# Altium schematic sheet MCU.SchDoc
size 381 x 241 mm; SheetNumber: 1; SheetTotal: 3
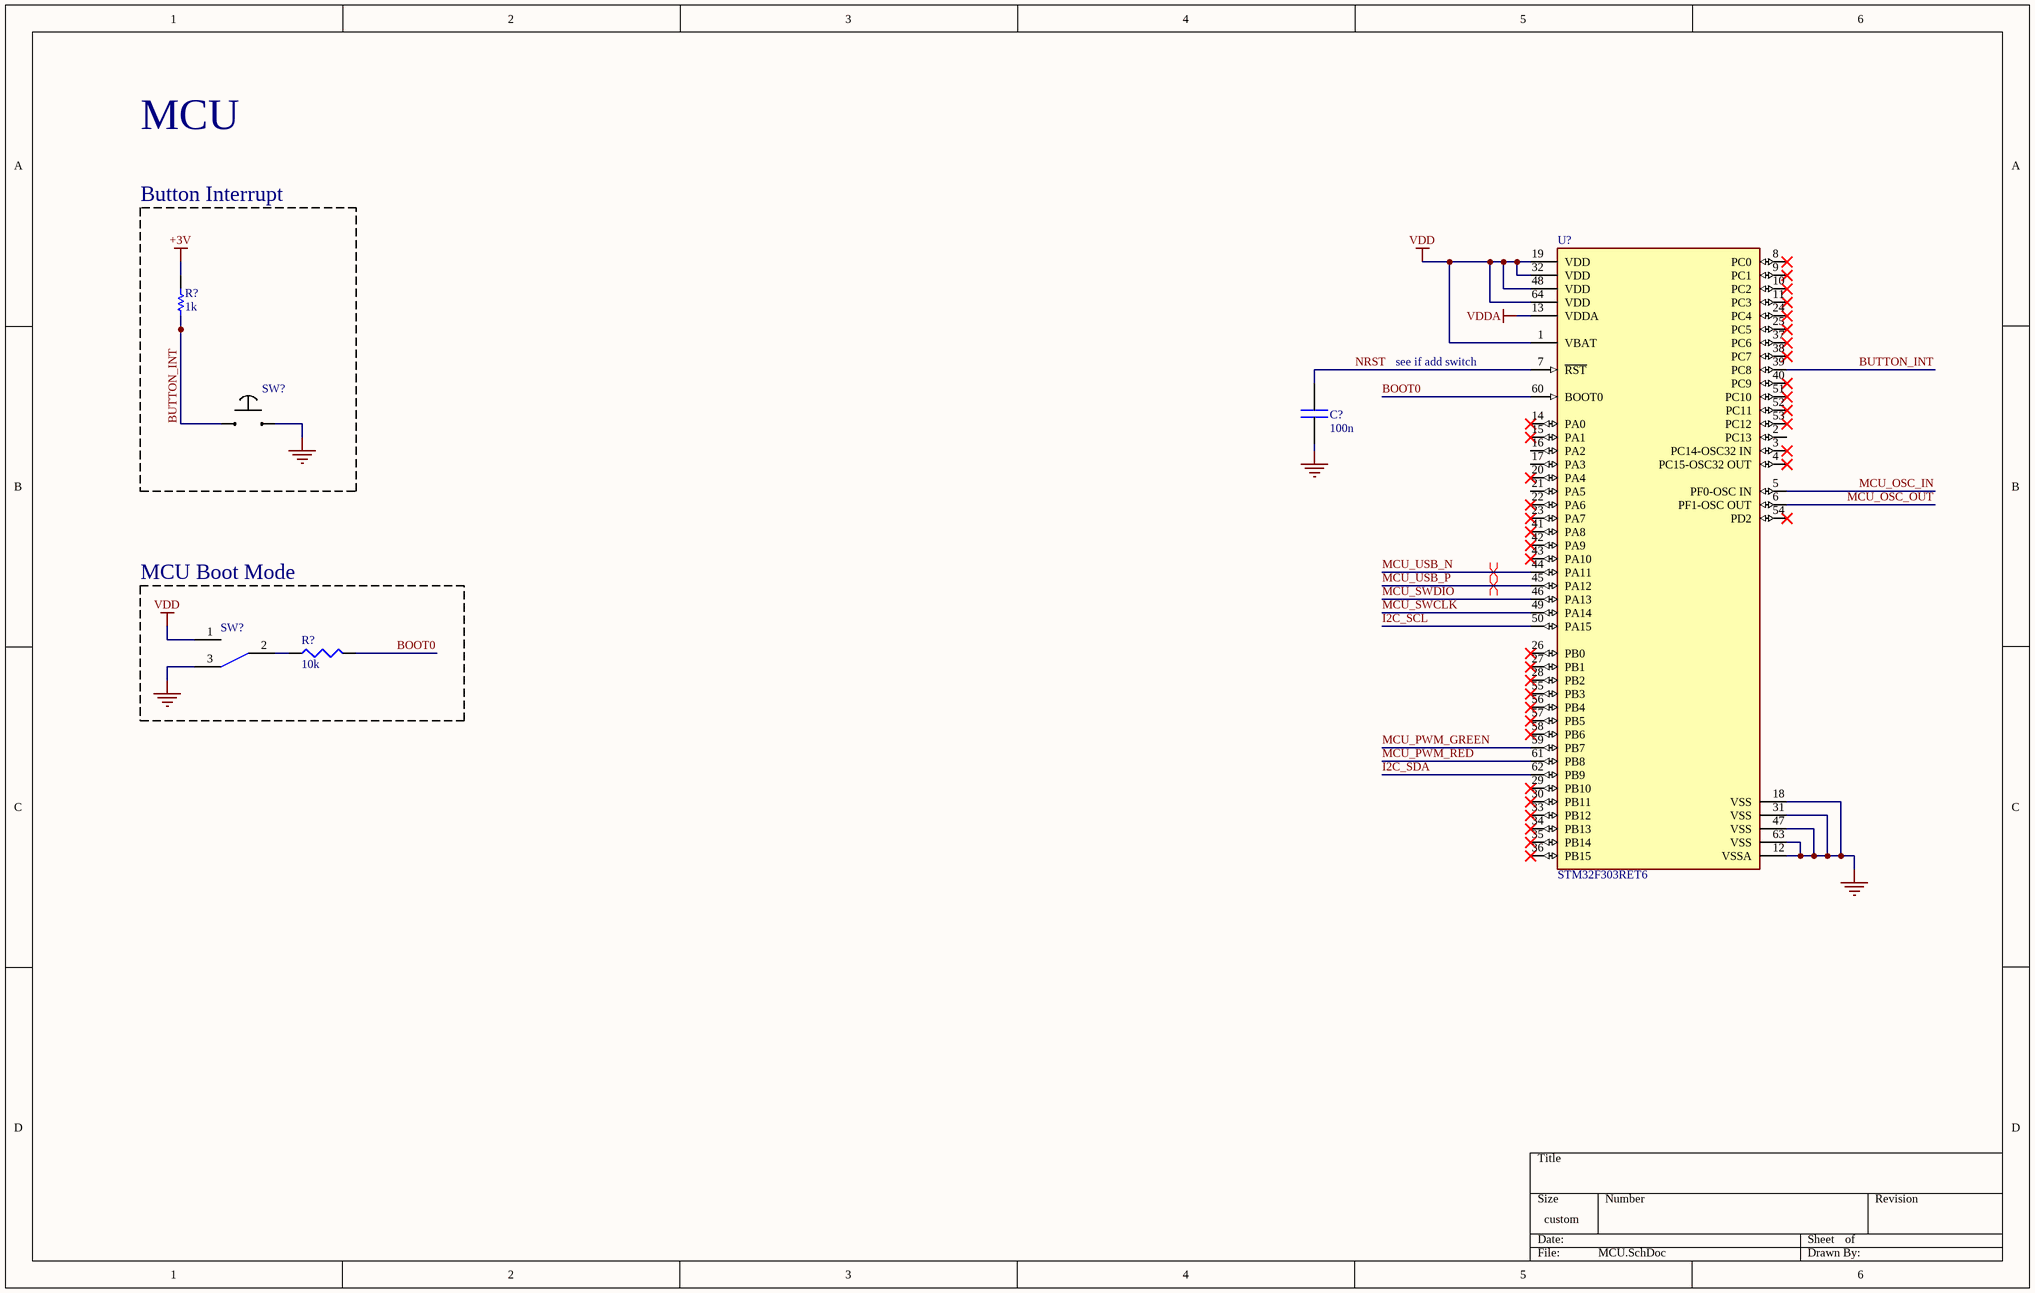
[diagram p0: MCU.SchDoc]

## Parts
(Parts that share a designator on the sheet are numbered #1, #2 ... from top to bottom, then left to right.)
C?  100n
R?#1  1k  [RESC1608X55X25LL10T15]
R?#2  10k
SW?#1  Momentary Button  (value not drawn)
SW?#2  CJS-1200TB1  (value not drawn)
U?  STM32F303RET6  [FP-LQFP64-5W-MFG]

## Blocks framed on the sheet
Button Interrupt: R?#1 SW?#1
MCU Boot Mode: R?#2 SW?#2

## Nets
+3V: R?#1.2
GND: C?.2 SW?#1.1 U?.12(VSSA) U?.18(VSS) U?.31(VSS) U?.47(VSS) U?.63(VSS)
VDD: U?.1(VBAT) U?.19(VDD) U?.32(VDD) U?.48(VDD) U?.64(VDD)
VDDA: U?.13(VDDA)
BOOT0: R?#2.2 U?.60(BOOT0)
BUTTON_INT: R?#1.1 SW?#1.0 U?.39(PC8)
I2C_SCL: U?.50(PA15)
I2C_SDA: U?.62(PB9)
MCU_OSC_IN: U?.5(PF0-OSC_IN)
MCU_OSC_OUT: U?.6(PF1-OSC_OUT)
MCU_PWM_GREEN: U?.59(PB7)
MCU_PWM_RED: U?.61(PB8)
MCU_SWCLK: U?.49(PA14)
MCU_SWDIO: U?.46(PA13)
MCU_USB_N: U?.44(PA11)
MCU_USB_P: U?.45(PA12)
NRST: C?.1 U?.7(~{RST})
NetR?#2_1: R?#2.1 SW?#2.2

Not connected (* = marked no-connect by the designer): SW?#2 1 3; U? 2(PC13) 3(PC14-OSC32_IN)* 4(PC15-OSC32_OUT)* 8(PC0)* 9(PC1)* 10(PC2)* 11(PC3)* 14(PA0)* 15(PA1)* 16(PA2) 17(PA3) 20(PA4)* 21(PA5) 22(PA6)* 23(PA7)* 24(PC4)* 25(PC5)* 26(PB0)* 27(PB1)* 28(PB2)* 29(PB10)* 30(PB11)* 33(PB12)* 34(PB13)* 35(PB14)* 36(PB15)* 37(PC6)* 38(PC7)* 40(PC9)* 41(PA8)* 42(PA9)* 43(PA10)* 51(PC10)* 52(PC11)* 53(PC12)* 54(PD2)* 55(PB3)* 56(PB4)* 57(PB5)* 58(PB6)*

## Layout directives
differential pair: MCU_USB_N, MCU_USB_P

## Notes on the sheet
- MCU
- see if add switch

## Library data of the parts
C? = CAP_0.1uF_0603: CAP CER 0.1UF 50V X7R 0603; Supplier 1: Mouser; Supplier Part Number 1: 81-GCM188R71H104JA7D
R?#1 = CMP-2000-04305-1: Manufacturer: Yageo; Part Number: RC0603JR-101KL
R?#2 = RES_0603_10K: RES 10K OHM 1% 1/10W 0603; Manufacturer: YAGEO; Manufacturer Part Number: AC0603FR-1310KL; Supplier 1: Arrow Electronics
SW?#1 = NCA2: SWITCH PB SPST-NO 25MA 50V; Manufacturer 1: CIT Relay and Switch; Supplier 1: Digi-Key; Supplier Part Number 1: 2449-NCA2-ND; Manufacturer Part Number 1: NCA2
SW?#2 = CJS-1200TB1: SWITCH SLIDE SPDT 100MA 6V; Supplier 1: Avnet
U? = CMP-0537-00048-2: IC MCU 32BIT 512KB FLASH 64LQFP; Manufacturer: STMicroelectronics; Data Bus Width: 32bits; Standoff Height: 0.05mm; Number Of Pwm Channels: 31; Number Of Timers/Counters: 6; Min Supply Voltage: 2V; Number Of Spi Channels: 4; Core Architecture: ARM Cortex-M4; Number Of I2C Channels: 3; Number Of Usb Channels: 1; Max Supply Voltage: 3.6V; Interface: I2C,SPI,UART,USART,CAN,USB,LIN,IrDA,I2S; Frequency: 72MHz; Max Junction Temp: +105°C; Number Of Uart Channels: 2; Number Of I/Os: 26; Memory Size: 512KBytes; Number Of Adc Channels: 22; Ram Size: 80KBytes; Nominal Supply Current: 4.27-66.4mA; ComponentLink2URL: https://www.st.com/resource/en/datasheet/stm32f303re.pdf; Automotive: No; Mouser Description: MCU 32-Bit STM32 ARM Cortex M4 RISC 512KB Flash 2.5V/3.3V 64-Pin LQFP Tray; Memory Type: FLASH; Temperature: -40°C to +105°C; Temperature Range Low: -40°C; Manufacturer Part Number: STM32F303RET6; Number Of A/D Converters: 4; Ambient Temperature Range High: +85°C; RoHS: TRUE; Category: IC; Ambient Temperature Range Low: -40°C; Number Of Cores: 1; Octopart: https://octopart.com/stm32f303ret6-stmicroelectronics-53115257; Height: 1.6mm; Device Class L2: Embedded Processors and Controllers; Device Class L3: Microcontrollers; Temperature Range High: +105°C; ComponentLink2Description: Datasheet; Lead Free: Yes; Digikey Description: IC MCU 32BIT 512KB FLASH 64LQFP; Package: LQFP64-5W; Device Class L1: Integrated Circuits (ICs)